# EAGLE schematic clock (EAGLE 9.3.1)
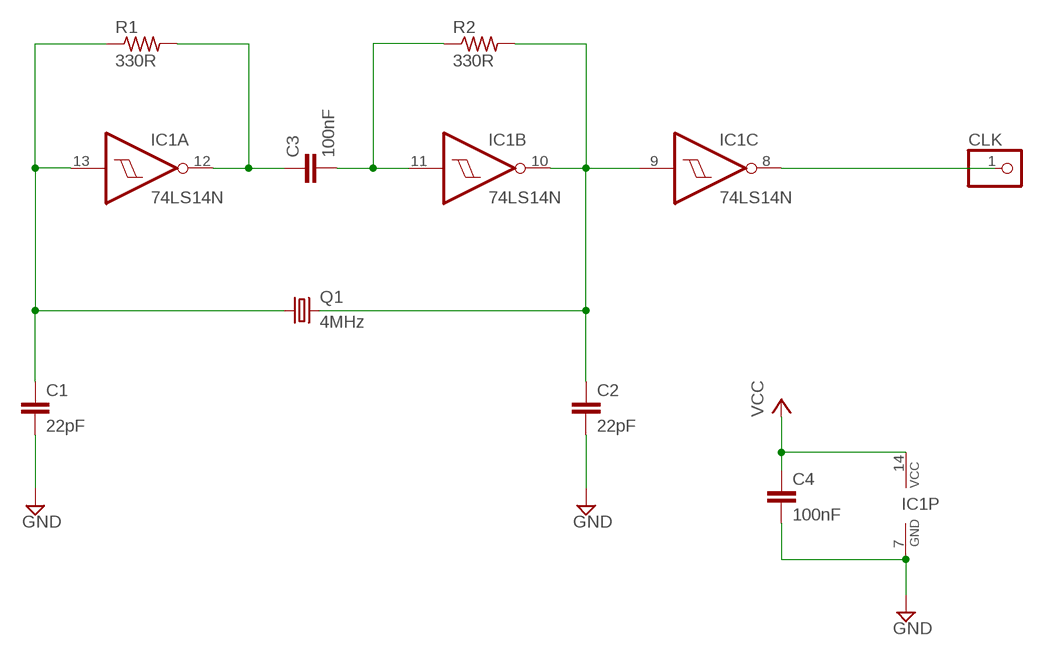
[diagram p0: schematic, sheet 1]

## Parts
C1  22pF  C-EU025-025X050  [C025-025X050]
C2  22pF  C-EU025-025X050  [C025-025X050]
C3  100nF  C-EU025-025X050  [C025-025X050]
C4  100nF  C-EU025-025X050  [C025-025X050]
CLK  PINHD-1X1  [1X01]
IC1  74LS14N  [DIL14]
Q1  4MHz  CRYSTALHC49S  [HC49/S]
R1  330R  R-US_0207/10  [0207/10]
R2  330R  R-US_0207/10  [0207/10]

## Nets
GND: C1.2 C2.2 C4.2 IC1.7(P:GND)
N$1: C3.1 IC1.12(A:O) R1.2
N$2: C3.2 IC1.11(B:I) R2.1
N$3: C2.1 IC1.9(C:I) IC1.10(B:O) Q1.2 R2.2
N$4: C1.1 IC1.13(A:I) Q1.1 R1.1
N$5: CLK.1 IC1.8(C:O)
VCC: C4.1 IC1.14(P:VCC)
Unconnected: IC1.1(D:I) IC1.2(D:O) IC1.3(E:I) IC1.4(E:O) IC1.5(F:I) IC1.6(F:O)

## Library data of the parts
C1-C4 = rcl:C-EU: CAPACITOR, European symbol; SPICEPREFIX: C
CLK = pinhead:PINHD-1X1: PIN HEADER
IC1 = 74xx-eu:74*14: Hex schmitt trigger INVERTER
Q1 = crystal:CRYSTAL: CRYSTAL; OC_FARNELL: 1667008; OC_NEWARK: unknown
R1 R2 = rcl:R-US_: RESISTOR, American symbol; SPICEPREFIX: R